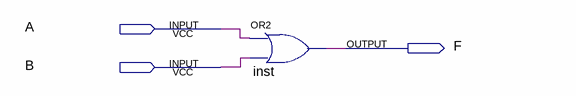
[diagram p0: schematic sheet]
// Quartus schematic orGate.bdf as structural Verilog: 1 symbols, 3 pins
module orGate (
  input  A,
  input  B,
  output F
);

  or inst (F, A, B);
endmodule
